# EAGLE design pig_led (EAGLE 6.6.0)
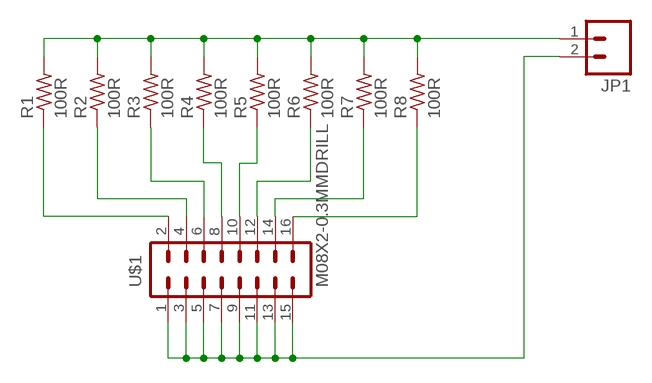
[diagram p0: schematic, sheet 1]

## Parts
JP1  M023.5MM  [SCREWTERMINAL-3.5MM-2]
R1  100R  RESISTOR0207/10  [0207/10]
R2  100R  RESISTOR0207/10  [0207/10]
R3  100R  RESISTOR0207/10  [0207/10]
R4  100R  RESISTOR0207/10  [0207/10]
R5  100R  RESISTOR0207/10  [0207/10]
R6  100R  RESISTOR0207/10  [0207/10]
R7  100R  RESISTOR0207/10  [0207/10]
R8  100R  RESISTOR0207/10  [0207/10]
U$1  M08X2-0.3MMDRILL  [2X8]

## Nets
GND: JP1.2 U$1.1 U$1.3 U$1.5 U$1.7 U$1.9 U$1.11 U$1.13 U$1.15
N$2: R1.1 U$1.2
N$3: R2.1 U$1.4
N$4: R3.1 U$1.6
N$5: R4.1 U$1.8
N$6: R5.1 U$1.10
N$7: R6.1 U$1.12
N$8: R7.1 U$1.14
N$9: R8.1 U$1.16
VCC: JP1.1 R1.2 R2.2 R3.2 R4.2 R5.2 R6.2 R7.2 R8.2

## Library data of the parts
JP1 = parts:M02: Header 2 Standard 2-pin 0.1" header. Use with straight break away headers (SKU : PRT-00116), right angle break away headers (PRT-00553), swiss pins (PRT-00743), machine pins (PRT-00117), and female headers (PRT-00115). Molex polarized connector foot print use with SKU : PRT-08233 with associated crimp pins and housings.
R1-R8 = parts:RESISTOR: RESISTOR
U$1 = parts:M08X2-0.3MMDRILL: .1" headers, two rows of 8 each

## Board
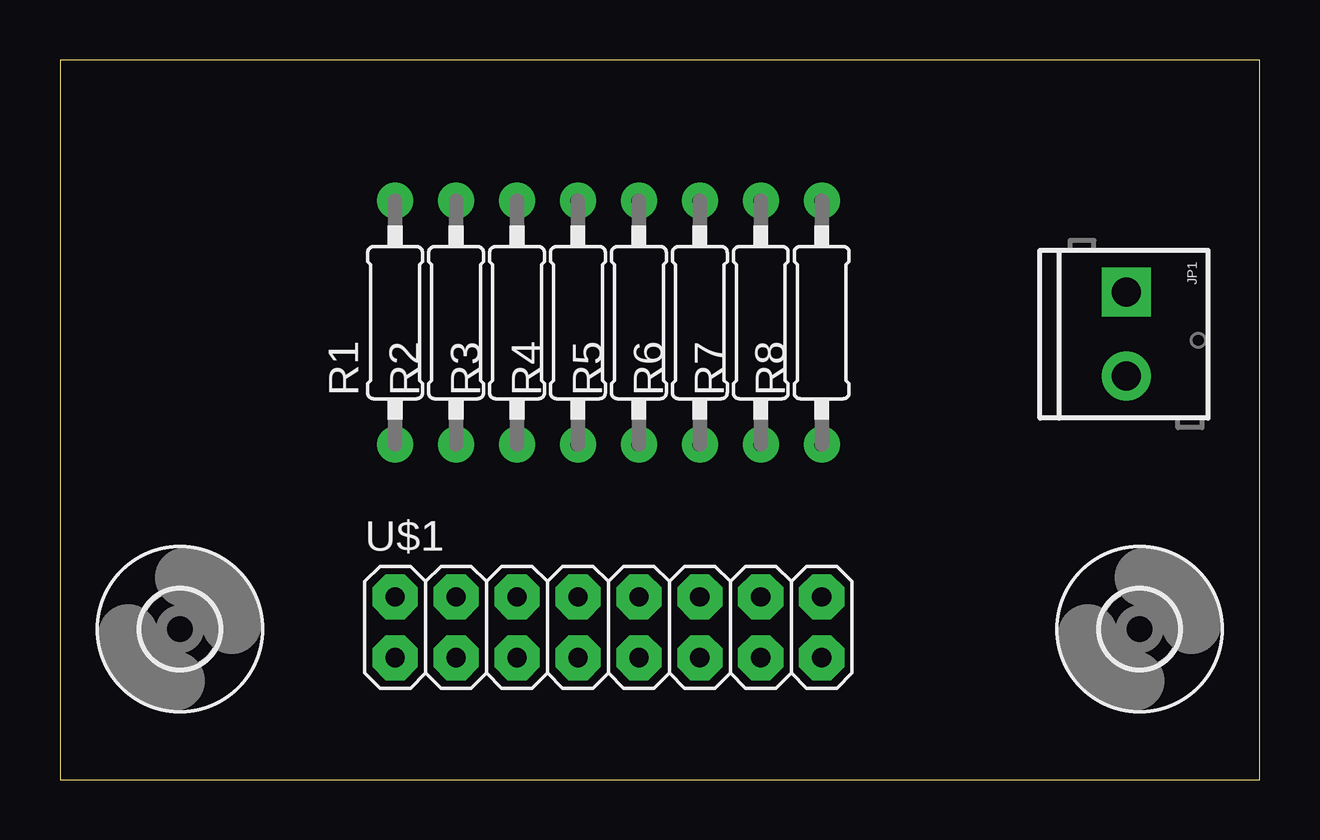
[diagram p1: board, top side]
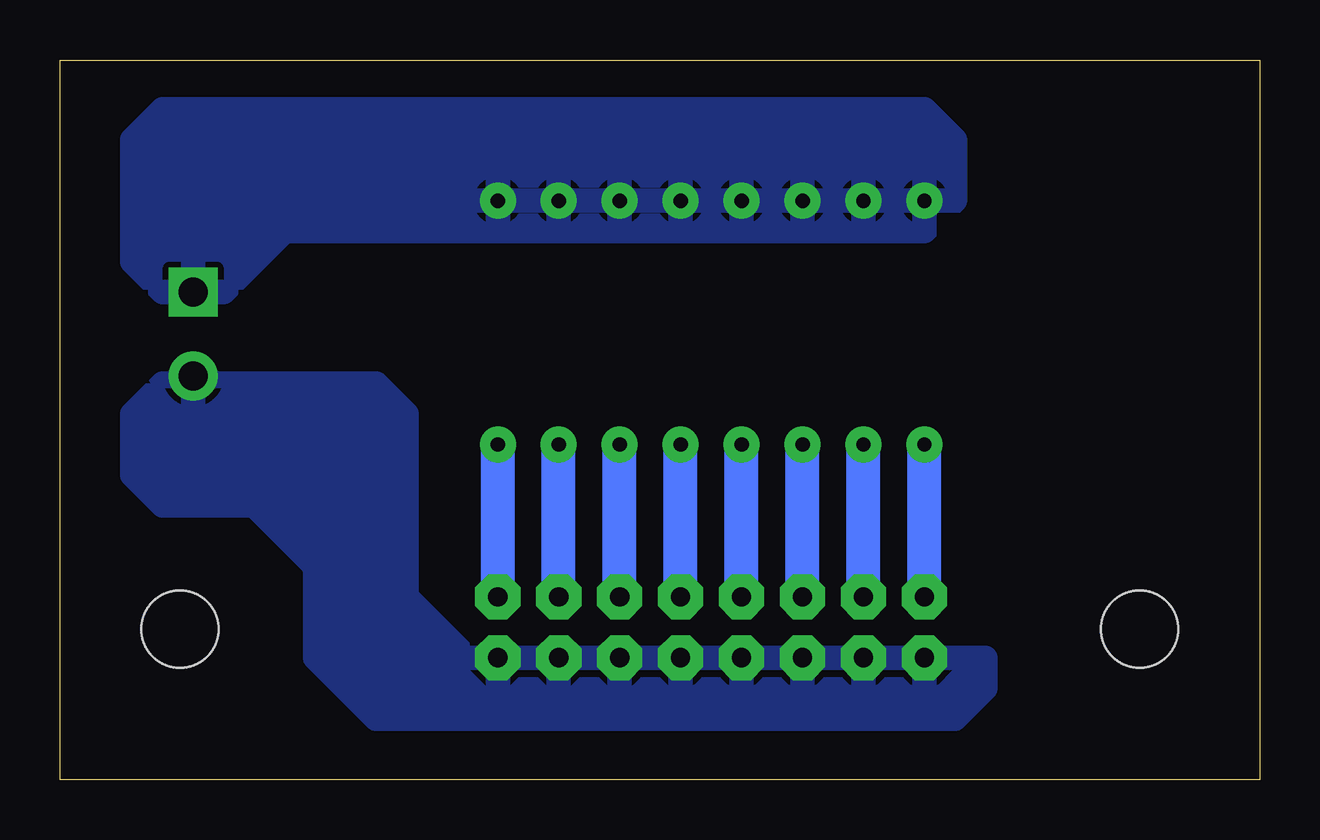
[diagram p2: board, bottom side, seen from below]

Size 50 x 30 mm. Coordinates in mm from the lower left corner, seen from the top.
Outline: 0,0 50,0 50,30 0,30 0,0
Copper layers (1*16): Top 0.035mm / dielectric 1.5mm / Bottom 0.035mm
Design rules "default": minimum track width 10mil, minimum drill 24mil, track to track 8mil, track to pad 8mil, pad to pad 8mil, via to via 8mil, smd to smd 8mil, copper to edge 40mil, drill to drill 8mil, minimum pad ring 10mil, minimum via ring 8mil, stop-mask expansion 4mil, vias tented up to drill 0mil, thermal gap 10mil

### Footprints (pad centres in the part's own frame; a part is rotated, then mirrored left to right if it is on the bottom)
SCREWTERMINAL-3.5MM-2 = drill 1.2 pad 2.032 square: 1 0,0 | drill 1.2 pad 2.032: 2 3.5,0
0207/10 = drill 0.6 pad 1.5: 1 -5.08,0; 2 5.08,0
2X8 = drill 0.8 pad 1.88 octagon: 1 0,0; 2 0,2.54; 3 2.54,0; 4 2.54,2.54; 5 5.08,0; 6 5.08,2.54; 7 7.62,0; 8 7.62,2.54; 9 10.16,0; 10 10.16,2.54; 11 12.7,0; 12 12.7,2.54; 13 15.24,0; 14 15.24,2.54; 15 17.78,0; 16 17.78,2.54
3,2 = hole 3.2: 0,0

### Placement (x,y rotation side)
JP1  44.45,20.32 270 top
R1  13.97,19.05 90 top
R2  16.51,19.05 90 top
R3  19.05,19.05 90 top
R4  21.59,19.05 90 top
R5  24.13,19.05 90 top
R6  26.67,19.05 90 top
R7  29.21,19.05 90 top
R8  31.75,19.05 90 top
U$1  13.97,5.08 0 top
U$2  [3,2]  5,6.27 0 top
U$3  [3,2]  45,6.27 0 top

### Tracks (layer width: path | path; a pad name or v marks a point on that pad's centre or on a via)
GND
  pour Bottom: 45.72,16.51 46.99,15.24 46.99,12.7 45.72,11.43 41.91,11.43 39.37,8.89 39.37,5.08 36.83,2.54 12.7,2.54 11.43,3.81 11.43,5.08 33.02,5.08 34.29,6.35 35.56,7.62 35.56,15.24 36.83,16.51
N$2
  Bottom 1.422: U$1.2 R1.1
N$3
  Bottom 1.422: U$1.4 R2.1
N$4
  Bottom 1.422: U$1.6 R3.1
N$5
  Bottom 1.422: U$1.8 R4.1
N$6
  Bottom 1.422: U$1.10 R5.1
N$7
  Bottom 1.422: U$1.12 R6.1
N$8
  Bottom 1.422: U$1.14 R7.1
N$9
  Bottom 1.422: U$1.16 R8.1
VCC
  pour Bottom: 13.97,27.94 45.72,27.94 46.99,26.67 46.99,21.59 45.72,20.32 43.18,20.32 40.64,22.86 13.97,22.86 12.7,24.13 12.7,26.67